# EAGLE design io-ok (EAGLE 6.6.0)

## Sheet 1 of 2
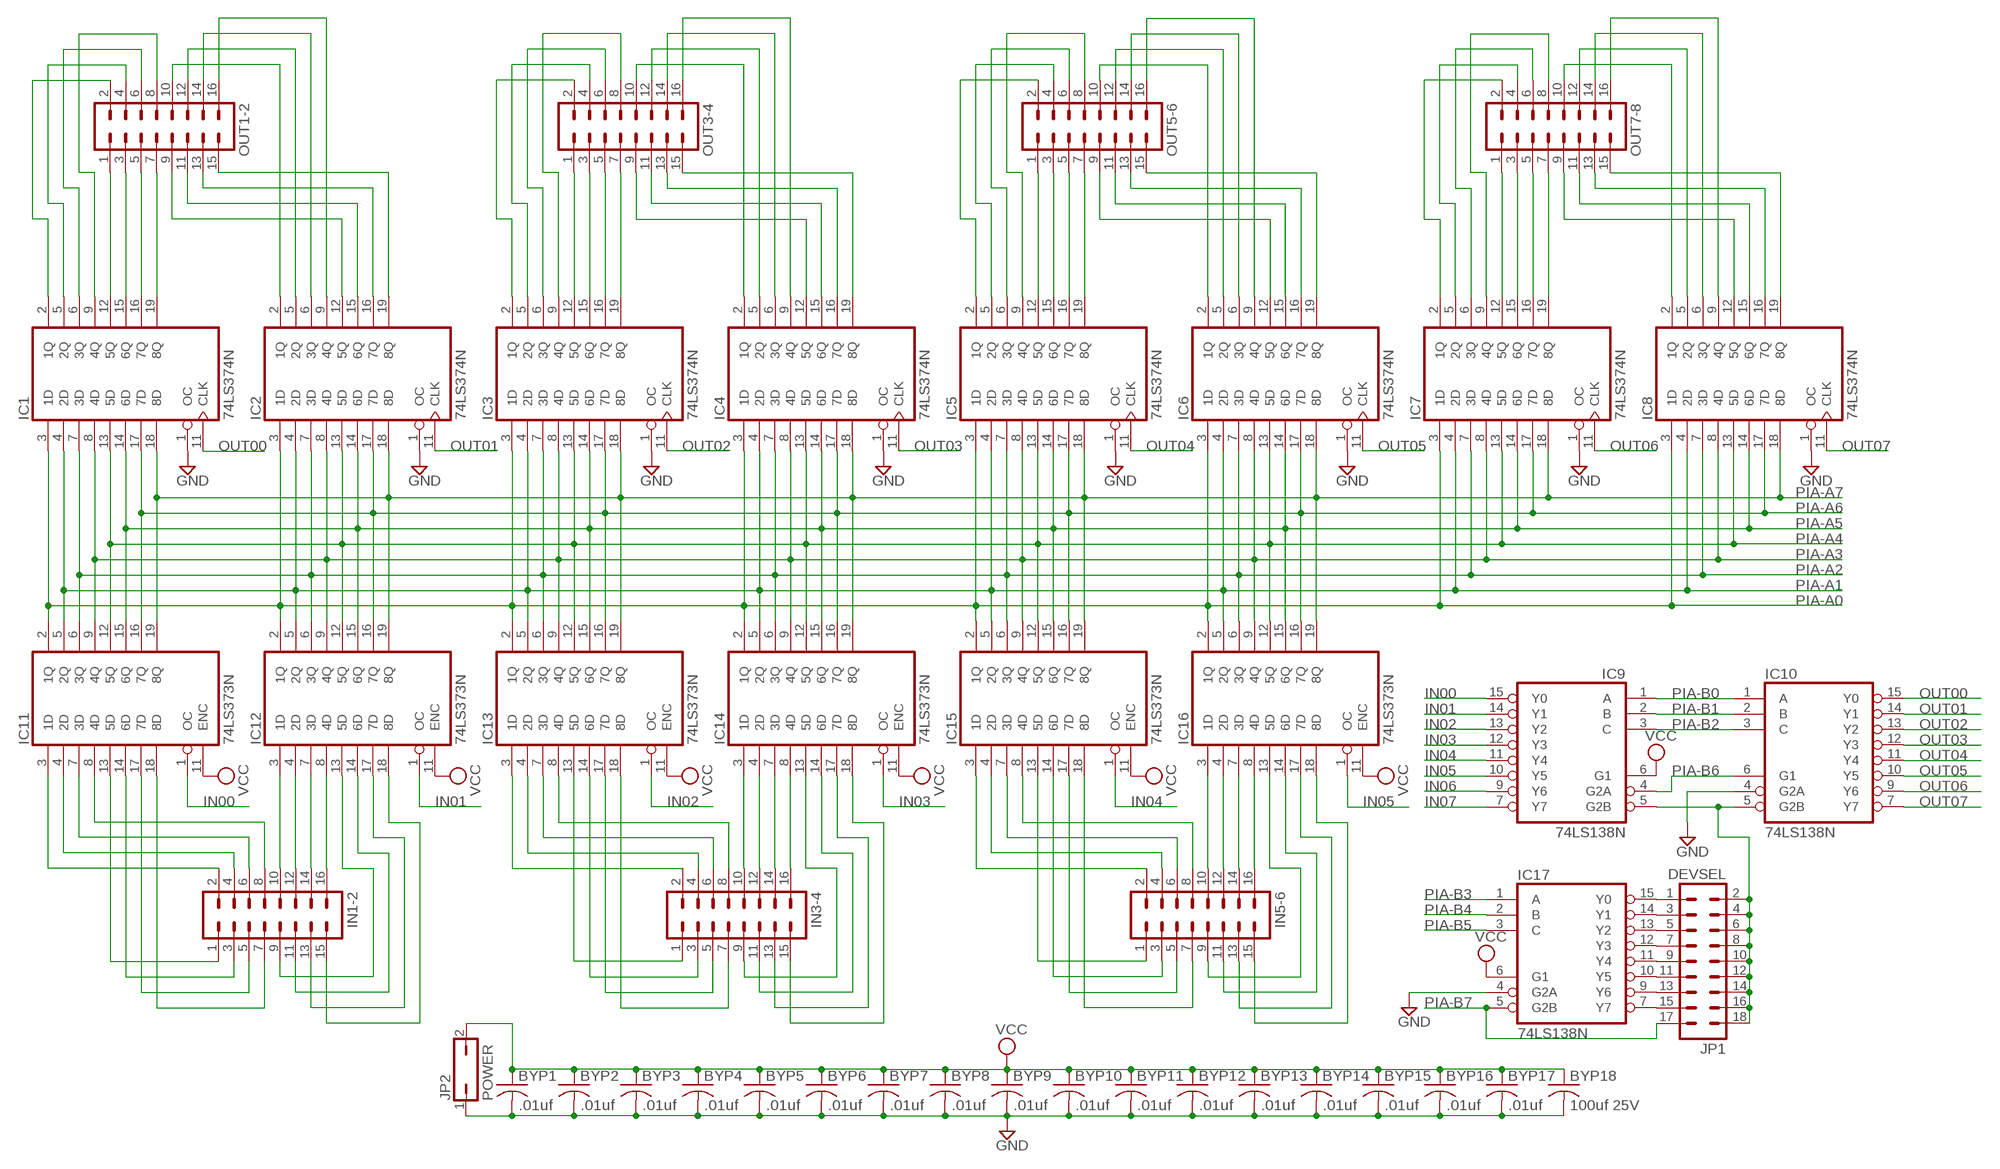
[diagram p0: schematic, sheet 1]

### Parts
BYP1  .01uf  C-US050-025X075  [C050-025X075]
BYP2  .01uf  C-US050-025X075  [C050-025X075]
BYP3  .01uf  C-US050-025X075  [C050-025X075]
BYP4  .01uf  C-US050-025X075  [C050-025X075]
BYP5  .01uf  C-US050-025X075  [C050-025X075]
BYP6  .01uf  C-US050-025X075  [C050-025X075]
BYP7  .01uf  C-US050-025X075  [C050-025X075]
BYP8  .01uf  C-US050-025X075  [C050-025X075]
BYP9  .01uf  C-US050-025X075  [C050-025X075]
BYP10  .01uf  C-US050-025X075  [C050-025X075]
BYP11  .01uf  C-US050-025X075  [C050-025X075]
BYP12  .01uf  C-US050-025X075  [C050-025X075]
BYP13  .01uf  C-US050-025X075  [C050-025X075]
BYP14  .01uf  C-US050-025X075  [C050-025X075]
BYP15  .01uf  C-US050-025X075  [C050-025X075]
BYP16  .01uf  C-US050-025X075  [C050-025X075]
BYP17  .01uf  C-US050-025X075  [C050-025X075]
BYP18  100uf 25V  C-US150-064X183  [C150-064X183]
IC1  74LS374N  [DIL20]
IC2  74LS374N  [DIL20]
IC3  74LS374N  [DIL20]
IC4  74LS374N  [DIL20]
IC5  74LS374N  [DIL20]
IC6  74LS374N  [DIL20]
IC7  74LS374N  [DIL20]
IC8  74LS374N  [DIL20]
IC9  74LS138N  [DIL16]
IC10  74LS138N  [DIL16]
IC11  74LS373N  [DIL20]
IC12  74LS373N  [DIL20]
IC13  74LS373N  [DIL20]
IC14  74LS373N  [DIL20]
IC15  74LS373N  [DIL20]
IC16  74LS373N  [DIL20]
IC17  74LS138N  [DIL16]
IN1-2  MA08-2  [MA08-2]
IN3-4  MA08-2  [MA08-2]
IN5-6  MA08-2  [MA08-2]
JP1  DEVSEL  MA09-2  [MA09-2]
JP2  POWER  JP1Q  [JP1]
OUT1-2  MA08-2  [MA08-2]
OUT3-4  MA08-2  [MA08-2]
OUT5-6  MA08-2  [MA08-2]
OUT7-8  MA08-2  [MA08-2]

### Nets
GND [Power]: BYP1.2 BYP2.2 BYP3.2 BYP4.2 BYP5.2 BYP6.2 BYP7.2 BYP8.2 BYP9.2 BYP10.2 BYP11.2 BYP12.2 BYP13.2 BYP14.2 BYP15.2 BYP16.2 BYP17.2 BYP18.2 IC1.1(OC) IC2.1(OC) IC3.1(OC) IC4.1(OC) IC5.1(OC) IC6.1(OC) IC7.1(OC) IC8.1(OC) IC10.4(G2A) IC17.4(G2A) JP2.1 ; also sheet 2
IN00: IC9.15(Y0) IC11.1(OC)
IN01: IC9.14(Y1) IC12.1(OC)
IN02: IC9.13(Y2) IC13.1(OC)
IN03: IC9.12(Y3) IC14.1(OC)
IN04: IC9.11(Y4) IC15.1(OC)
IN05: IC9.10(Y5) IC16.1(OC)
IN06: IC9.9(Y6)
IN07: IC9.7(Y7)
N$1: IC12.3(1D) IN1-2.10
N$2: IC12.4(2D) IN1-2.12
N$3: IC17.15(Y0) JP1.1
N$4: IC17.14(Y1) JP1.3
N$5: IC17.13(Y2) JP1.5
N$6: IC17.12(Y3) JP1.7
N$7: IC12.7(3D) IN1-2.14
N$8: IC12.8(4D) IN1-2.16
N$9: IC11.8(4D) IN1-2.8
N$10: IC11.7(3D) IN1-2.6
N$11: IC11.4(2D) IN1-2.4
N$12: IC11.3(1D) IN1-2.2
N$13: IC11.13(5D) IN1-2.1
N$14: IC11.14(6D) IN1-2.3
N$15: IC11.17(7D) IN1-2.5
N$16: IC11.18(8D) IN1-2.7
N$17: IC12.13(5D) IN1-2.9
N$18: IC12.14(6D) IN1-2.11
N$19: IC12.17(7D) IN1-2.13
N$20: IC12.18(8D) IN1-2.15
N$21: IC17.11(Y4) JP1.9
N$22: IC17.10(Y5) JP1.11
N$23: IC17.9(Y6) JP1.13
N$24: IC17.7(Y7) JP1.15
N$25: IC9.5(G2B) IC10.5(G2B) JP1.2 JP1.4 JP1.6 JP1.8 JP1.10 JP1.12 JP1.14 JP1.16 JP1.18
N$26: IC5.2(1Q) OUT5-6.2
N$27: IC7.2(1Q) OUT7-8.2
N$29: IC14.3(1D) IN3-4.10
N$30: IC14.4(2D) IN3-4.12
N$31: IC14.7(3D) IN3-4.14
N$32: IC14.8(4D) IN3-4.16
N$33: IC3.12(5Q) OUT3-4.1
N$34: IC3.15(6Q) OUT3-4.3
N$35: IC3.16(7Q) OUT3-4.5
N$36: IC3.19(8Q) OUT3-4.7
N$37: IC13.3(1D) IN3-4.2
N$38: IC13.4(2D) IN3-4.4
N$39: IC13.7(3D) IN3-4.6
N$40: IC13.8(4D) IN3-4.8
N$41: IC14.13(5D) IN3-4.9
N$42: IC14.14(6D) IN3-4.11
N$43: IC14.17(7D) IN3-4.13
N$44: IC14.18(8D) IN3-4.15
N$45: IC13.13(5D) IN3-4.1
N$46: IC13.14(6D) IN3-4.3
N$47: IC13.17(7D) IN3-4.5
N$48: IC13.18(8D) IN3-4.7
N$49: IC3.5(2Q) OUT3-4.4
N$50: IC3.6(3Q) OUT3-4.6
N$51: IC3.2(1Q) OUT3-4.2
N$52: IC3.9(4Q) OUT3-4.8
N$53: IC1.12(5Q) OUT1-2.1
N$54: IC1.15(6Q) OUT1-2.3
N$55: IC1.16(7Q) OUT1-2.5
N$56: IC1.19(8Q) OUT1-2.7
N$57: IC1.2(1Q) OUT1-2.2
N$58: IC1.5(2Q) OUT1-2.4
N$59: IC1.6(3Q) OUT1-2.6
N$60: IC1.9(4Q) OUT1-2.8
N$61: IC2.19(8Q) OUT1-2.15
N$62: IC2.16(7Q) OUT1-2.13
N$63: IC2.15(6Q) OUT1-2.11
N$64: IC2.12(5Q) OUT1-2.9
N$65: IC2.2(1Q) OUT1-2.10
N$66: IC2.5(2Q) OUT1-2.12
N$67: IC2.6(3Q) OUT1-2.14
N$68: IC2.9(4Q) OUT1-2.16
N$69: IC4.2(1Q) OUT3-4.10
N$70: IC4.5(2Q) OUT3-4.12
N$71: IC4.6(3Q) OUT3-4.14
N$72: IC4.9(4Q) OUT3-4.16
N$73: IC4.19(8Q) OUT3-4.15
N$74: IC4.16(7Q) OUT3-4.13
N$75: IC4.15(6Q) OUT3-4.11
N$76: IC4.12(5Q) OUT3-4.9
N$77: IC16.3(1D) IN5-6.10
N$78: IC16.4(2D) IN5-6.12
N$79: IC16.7(3D) IN5-6.14
N$80: IC16.8(4D) IN5-6.16
N$81: IC5.12(5Q) OUT5-6.1
N$82: IC5.15(6Q) OUT5-6.3
N$83: IC5.16(7Q) OUT5-6.5
N$84: IC5.19(8Q) OUT5-6.7
N$85: IC7.12(5Q) OUT7-8.1
N$86: IC7.15(6Q) OUT7-8.3
N$87: IC7.16(7Q) OUT7-8.5
N$88: IC7.19(8Q) OUT7-8.7
N$89: IC5.5(2Q) OUT5-6.4
N$90: IC5.6(3Q) OUT5-6.6
N$91: IC5.9(4Q) OUT5-6.8
N$92: IC6.12(5Q) OUT5-6.9
N$93: IC6.15(6Q) OUT5-6.11
N$95: IC6.16(7Q) OUT5-6.13
N$96: IC6.19(8Q) OUT5-6.15
N$97: IC6.2(1Q) OUT5-6.10
N$98: IC6.5(2Q) OUT5-6.12
N$99: IC6.6(3Q) OUT5-6.14
N$100: IC6.9(4Q) OUT5-6.16
N$101: IC15.3(1D) IN5-6.2
N$102: IC15.4(2D) IN5-6.4
N$103: IC15.7(3D) IN5-6.6
N$104: IC15.8(4D) IN5-6.8
N$105: IC16.13(5D) IN5-6.9
N$106: IC16.14(6D) IN5-6.11
N$107: IC16.17(7D) IN5-6.13
N$108: IC16.18(8D) IN5-6.15
N$109: IC15.13(5D) IN5-6.1
N$110: IC15.14(6D) IN5-6.3
N$111: IC15.17(7D) IN5-6.5
N$112: IC15.18(8D) IN5-6.7
N$113: IC8.19(8Q) OUT7-8.15
N$114: IC8.16(7Q) OUT7-8.13
N$115: IC8.15(6Q) OUT7-8.11
N$116: IC8.12(5Q) OUT7-8.9
N$117: IC8.2(1Q) OUT7-8.10
N$118: IC8.5(2Q) OUT7-8.12
N$119: IC8.6(3Q) OUT7-8.14
N$120: IC8.9(4Q) OUT7-8.16
N$121: IC7.9(4Q) OUT7-8.8
N$122: IC7.6(3Q) OUT7-8.6
N$123: IC7.5(2Q) OUT7-8.4
OUT00: IC1.11(CLK) IC10.15(Y0)
OUT01: IC2.11(CLK) IC10.14(Y1)
OUT02: IC3.11(CLK) IC10.13(Y2)
OUT03: IC4.11(CLK) IC10.12(Y3)
OUT04: IC5.11(CLK) IC10.11(Y4)
OUT05: IC6.11(CLK) IC10.10(Y5)
OUT06: IC7.11(CLK) IC10.9(Y6)
OUT07: IC8.11(CLK) IC10.7(Y7)
PIA-A0: IC1.3(1D) IC2.3(1D) IC3.3(1D) IC4.3(1D) IC5.3(1D) IC6.3(1D) IC7.3(1D) IC8.3(1D) IC11.2(1Q) IC12.2(1Q) IC13.2(1Q) IC14.2(1Q) IC15.2(1Q) IC16.2(1Q) ; also sheet 2
PIA-A1: IC1.4(2D) IC2.4(2D) IC3.4(2D) IC4.4(2D) IC5.4(2D) IC6.4(2D) IC7.4(2D) IC8.4(2D) IC11.5(2Q) IC12.5(2Q) IC13.5(2Q) IC14.5(2Q) IC15.5(2Q) IC16.5(2Q) ; also sheet 2
PIA-A2: IC1.7(3D) IC2.7(3D) IC3.7(3D) IC4.7(3D) IC5.7(3D) IC6.7(3D) IC7.7(3D) IC8.7(3D) IC11.6(3Q) IC12.6(3Q) IC13.6(3Q) IC14.6(3Q) IC15.6(3Q) IC16.6(3Q) ; also sheet 2
PIA-A3: IC1.8(4D) IC2.8(4D) IC3.8(4D) IC4.8(4D) IC5.8(4D) IC6.8(4D) IC7.8(4D) IC8.8(4D) IC11.9(4Q) IC12.9(4Q) IC13.9(4Q) IC14.9(4Q) IC15.9(4Q) IC16.9(4Q) ; also sheet 2
PIA-A4: IC1.13(5D) IC2.13(5D) IC3.13(5D) IC4.13(5D) IC5.13(5D) IC6.13(5D) IC7.13(5D) IC8.13(5D) IC11.12(5Q) IC12.12(5Q) IC13.12(5Q) IC14.12(5Q) IC15.12(5Q) IC16.12(5Q) ; also sheet 2
PIA-A5: IC1.14(6D) IC2.14(6D) IC3.14(6D) IC4.14(6D) IC5.14(6D) IC6.14(6D) IC7.14(6D) IC8.14(6D) IC11.15(6Q) IC12.15(6Q) IC13.15(6Q) IC14.15(6Q) IC15.15(6Q) IC16.15(6Q) ; also sheet 2
PIA-A6: IC1.17(7D) IC2.17(7D) IC3.17(7D) IC4.17(7D) IC5.17(7D) IC6.17(7D) IC7.17(7D) IC8.17(7D) IC11.16(7Q) IC12.16(7Q) IC13.16(7Q) IC14.16(7Q) IC15.16(7Q) IC16.16(7Q) ; also sheet 2
PIA-A7: IC1.18(8D) IC2.18(8D) IC3.18(8D) IC4.18(8D) IC5.18(8D) IC6.18(8D) IC7.18(8D) IC8.18(8D) IC11.19(8Q) IC12.19(8Q) IC13.19(8Q) IC14.19(8Q) IC15.19(8Q) IC16.19(8Q) ; also sheet 2
PIA-B0: IC9.1(A) IC10.1(A) ; also sheet 2
PIA-B1: IC9.2(B) IC10.2(B) ; also sheet 2
PIA-B2: IC9.3(C) IC10.3(C) ; also sheet 2
PIA-B3: IC17.1(A) ; also sheet 2
PIA-B4: IC17.2(B) ; also sheet 2
PIA-B5: IC17.3(C) ; also sheet 2
PIA-B6: IC9.4(G2A) IC10.6(G1) ; also sheet 2
PIA-B7: IC17.5(G2B) JP1.17 ; also sheet 2
VCC [Power]: BYP1.1 BYP2.1 BYP3.1 BYP4.1 BYP5.1 BYP6.1 BYP7.1 BYP8.1 BYP9.1 BYP10.1 BYP11.1 BYP12.1 BYP13.1 BYP14.1 BYP15.1 BYP16.1 BYP17.1 BYP18.1 IC9.6(G1) IC11.11(ENC) IC12.11(ENC) IC13.11(ENC) IC14.11(ENC) IC15.11(ENC) IC16.11(ENC) IC17.6(G1) JP2.2 ; also sheet 2

## Sheet 2 of 2
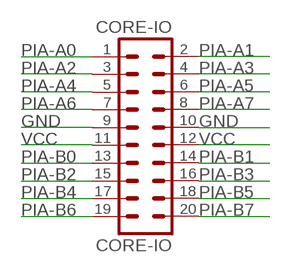
[diagram p1: schematic, sheet 2]

### Parts
CORE-IO  CORE-IO  MA10-2  [MA10-2]

### Nets
GND [Power]: CORE-IO.9 CORE-IO.10 ; also sheet 1
PIA-A0: CORE-IO.1 ; also sheet 1
PIA-A1: CORE-IO.2 ; also sheet 1
PIA-A2: CORE-IO.3 ; also sheet 1
PIA-A3: CORE-IO.4 ; also sheet 1
PIA-A4: CORE-IO.5 ; also sheet 1
PIA-A5: CORE-IO.6 ; also sheet 1
PIA-A6: CORE-IO.7 ; also sheet 1
PIA-A7: CORE-IO.8 ; also sheet 1
PIA-B0: CORE-IO.13 ; also sheet 1
PIA-B1: CORE-IO.14 ; also sheet 1
PIA-B2: CORE-IO.15 ; also sheet 1
PIA-B3: CORE-IO.16 ; also sheet 1
PIA-B4: CORE-IO.17 ; also sheet 1
PIA-B5: CORE-IO.18 ; also sheet 1
PIA-B6: CORE-IO.19 ; also sheet 1
PIA-B7: CORE-IO.20 ; also sheet 1
VCC [Power]: CORE-IO.11 CORE-IO.12 ; also sheet 1

## Power pins joined to a net without a drawn wire
GND: IC1.10(GND) IC2.10(GND) IC3.10(GND) IC4.10(GND) IC5.10(GND) IC6.10(GND) IC7.10(GND) IC8.10(GND) IC9.8(GND) IC10.8(GND) IC11.10(GND) IC12.10(GND) IC13.10(GND) IC14.10(GND) IC15.10(GND) IC16.10(GND) IC17.8(GND)
VCC: IC1.20(VCC) IC2.20(VCC) IC3.20(VCC) IC4.20(VCC) IC5.20(VCC) IC6.20(VCC) IC7.20(VCC) IC8.20(VCC) IC9.16(VCC) IC10.16(VCC) IC11.20(VCC) IC12.20(VCC) IC13.20(VCC) IC14.20(VCC) IC15.20(VCC) IC16.20(VCC) IC17.16(VCC)

## Library data of the parts
BYP1-BYP18 = rcl:C-US: CAPACITOR, American symbol
CORE-IO = con-lstb:MA10-2: PIN HEADER; OC_FARNELL: unknown; OC_NEWARK: unknown
IC1-IC8 = 74xx-us:74*374: Octal D type transparent LATCH, edge triggered
IC9 IC10 IC17 = 74xx-us:74*138: 3-line to 8-line DECODER/DEMULTIPLEXER
IC11-IC16 = 74xx-us:74*373: Octal D type transparent LATCH, edge triggered
IN1-2 IN3-4 IN5-6 OUT1-2 OUT3-4 OUT5-6 OUT7-8 = con-lstb:MA08-2: PIN HEADER; OC_FARNELL: unknown; OC_NEWARK: unknown
JP1 = con-lstb:MA09-2: PIN HEADER; OC_FARNELL: unknown; OC_NEWARK: unknown
JP2 = jumper:JP1Q: JUMPER

## Net classes
1 Power: width 0.508 mm, drill 0.254 mm, clearance 0.254 mm

## Board
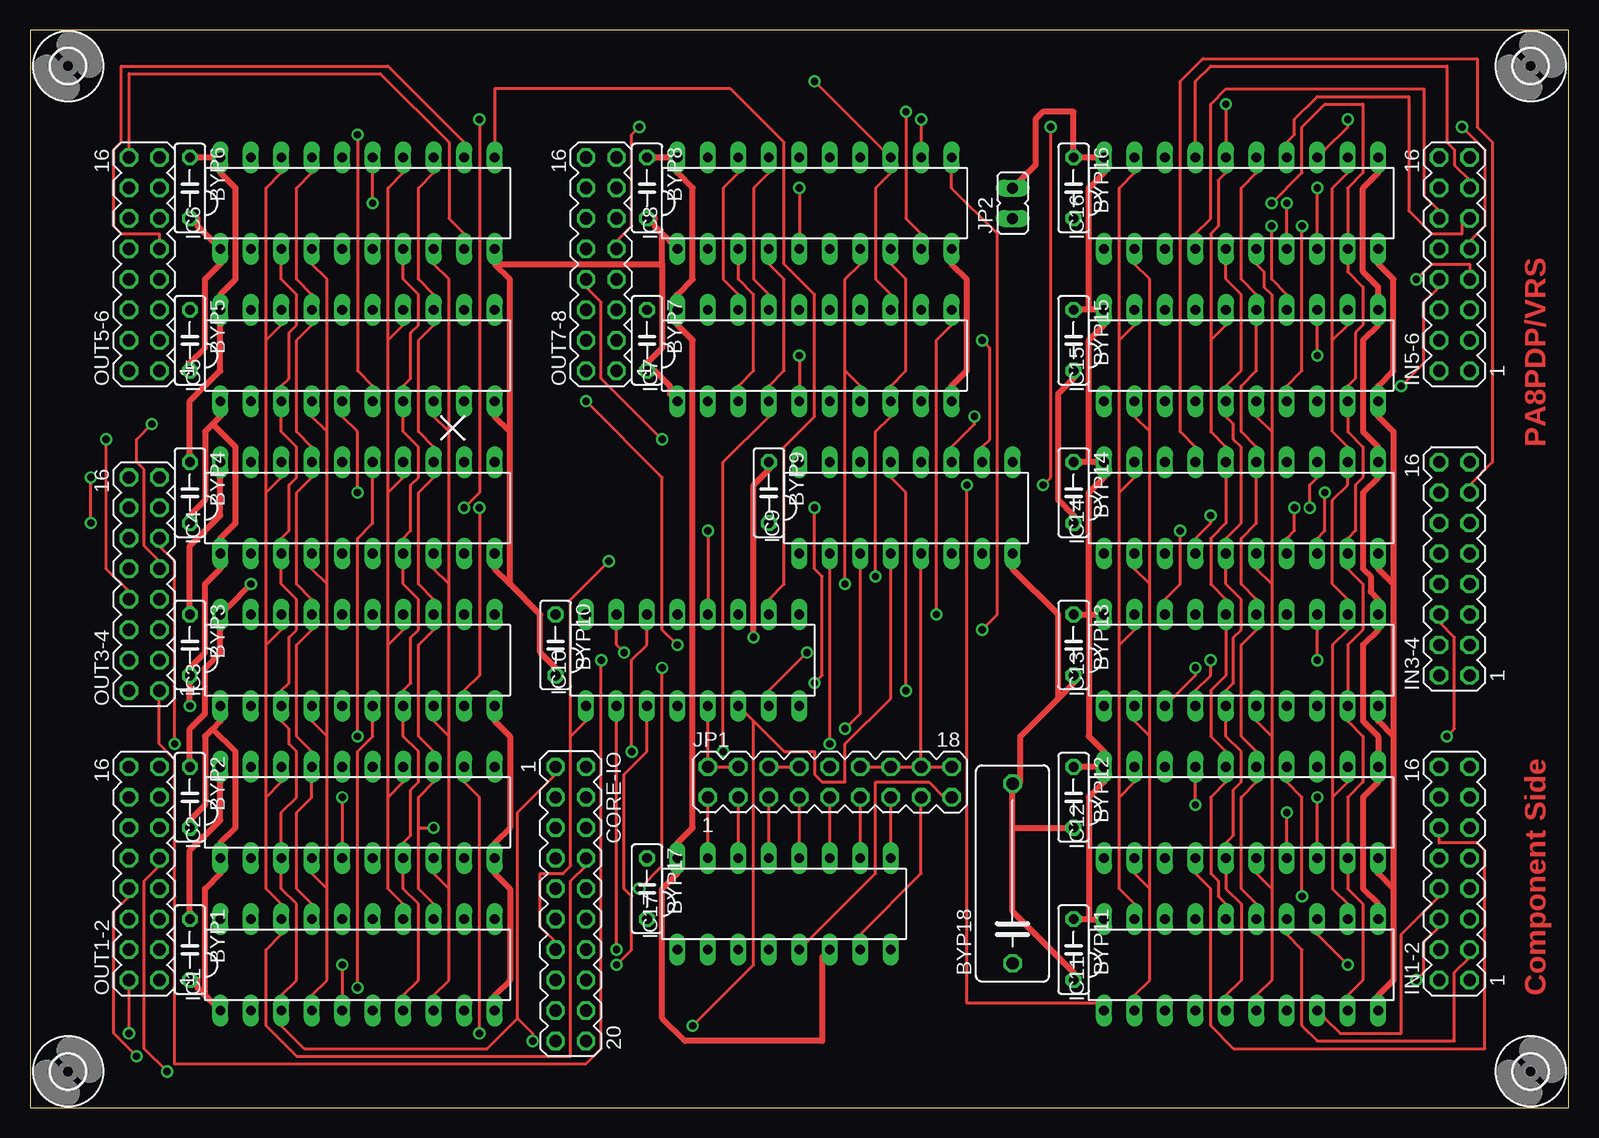
[diagram p2: board, top side]
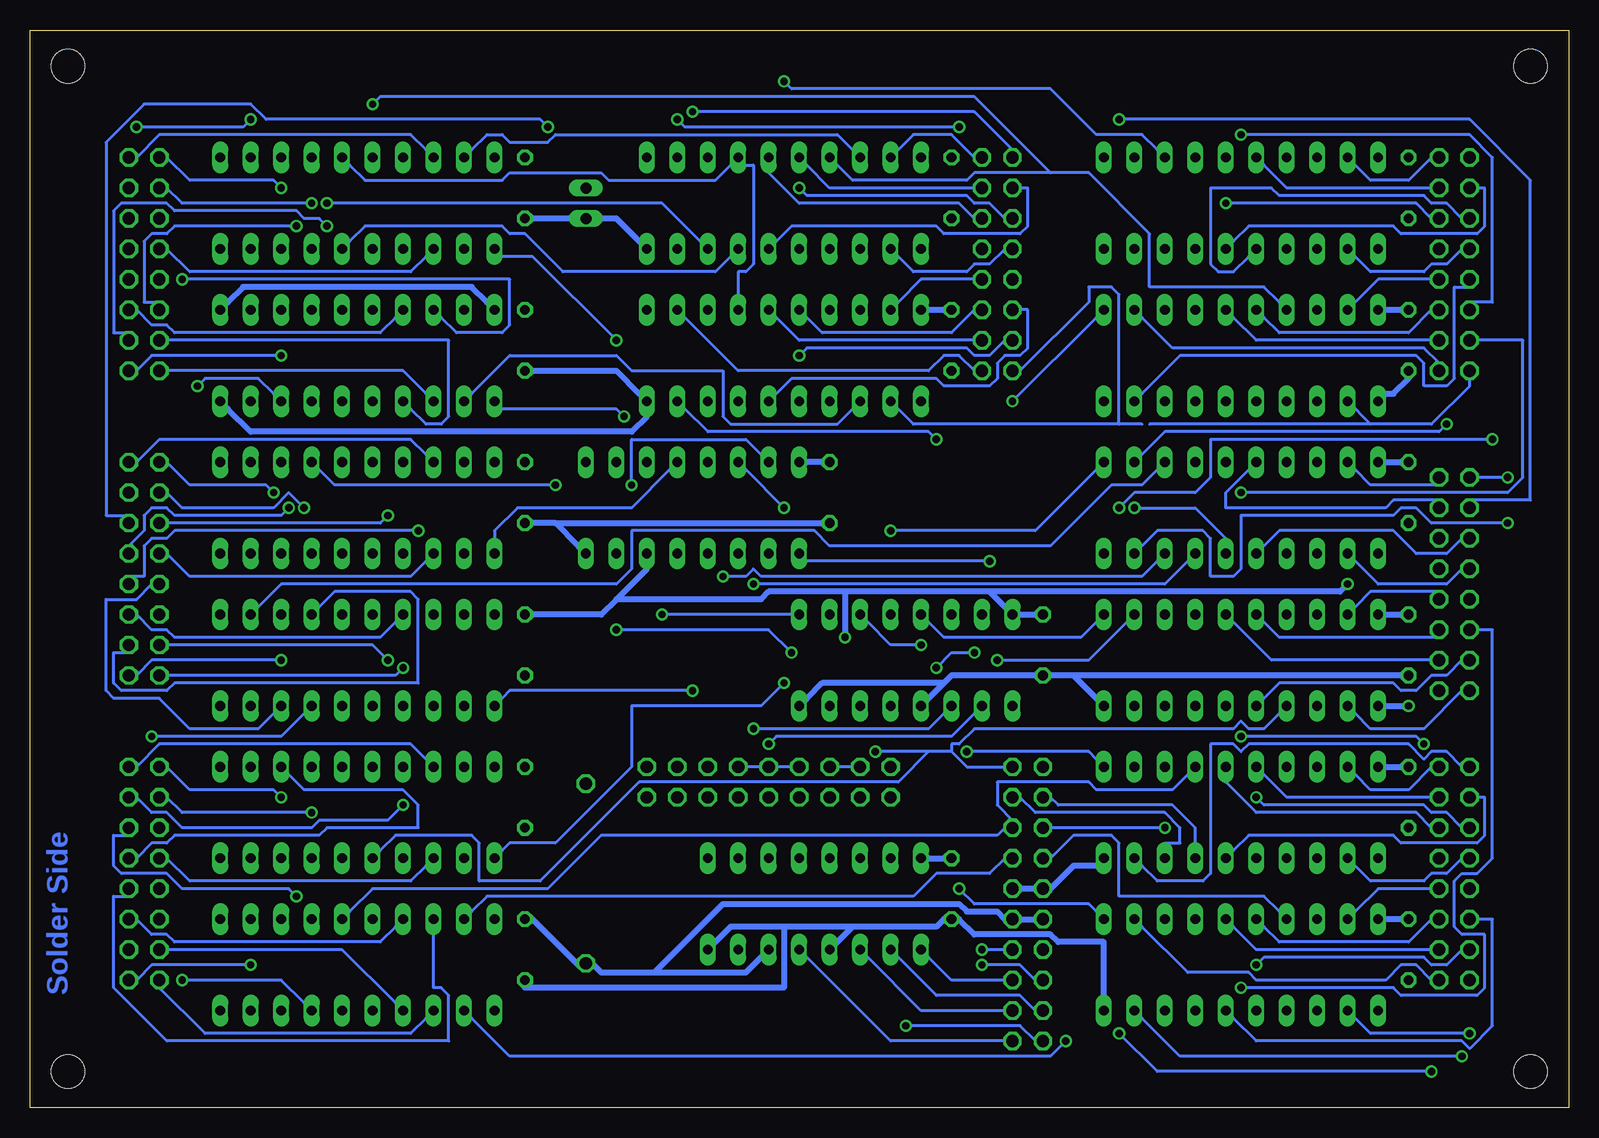
[diagram p3: board, bottom side, seen from below]

Size 128.25 x 89.84 mm. Coordinates in mm from the lower left corner, seen from the top.
Outline: 0,0 128.25,0 128.25,89.84 0,89.84 0,0
Copper layers (1*16): Top 0.035mm / dielectric 1.5mm / Bottom 0.035mm
Design rules "olimex10mil": minimum track width 10mil, minimum drill 24mil, track to track 10mil, track to pad 10mil, pad to pad 10mil, via to via 10mil, smd to smd 10mil, copper to edge 40mil, drill to drill 10mil, minimum pad ring 10mil, minimum via ring 8mil, stop-mask expansion 0mil, vias tented up to drill 0mil, thermal gap 10mil

### Footprints (pad centres in the part's own frame; a part is rotated, then mirrored left to right if it is on the bottom)
C050-025X075 = drill 0.813 octagon: 1 -2.54,0; 2 2.54,0
C150-064X183 = drill 1.016 octagon: 1 -7.493,0; 2 7.493,0
MA10-2 = drill 1.016 octagon: 1 -11.43,-1.27; 2 -11.43,1.27; 3 -8.89,-1.27; 4 -8.89,1.27; 5 -6.35,-1.27; 6 -6.35,1.27; 7 -3.81,-1.27; 8 -3.81,1.27; 9 -1.27,-1.27; 10 -1.27,1.27; 11 1.27,-1.27; 12 1.27,1.27; 13 3.81,-1.27; 14 3.81,1.27; 15 6.35,-1.27; 16 6.35,1.27; 17 8.89,-1.27; 18 8.89,1.27; 19 11.43,-1.27; 20 11.43,1.27
DIL20 = drill 0.813 long: 1 -11.43,-3.81; 2 -8.89,-3.81; 3 -6.35,-3.81; 4 -3.81,-3.81; 5 -1.27,-3.81; 6 1.27,-3.81; 7 3.81,-3.81; 8 6.35,-3.81; 9 8.89,-3.81; 10 11.43,-3.81; 11 11.43,3.81; 12 8.89,3.81; 13 6.35,3.81; 14 3.81,3.81; 15 1.27,3.81; 16 -1.27,3.81; 17 -3.81,3.81; 18 -6.35,3.81; 19 -8.89,3.81; 20 -11.43,3.81
DIL16 = drill 0.813 long: 1 -8.89,-3.81; 2 -6.35,-3.81; 3 -3.81,-3.81; 4 -1.27,-3.81; 5 1.27,-3.81; 6 3.81,-3.81; 7 6.35,-3.81; 8 8.89,-3.81; 9 8.89,3.81; 10 6.35,3.81; 11 3.81,3.81; 12 1.27,3.81; 13 -1.27,3.81; 14 -3.81,3.81; 15 -6.35,3.81; 16 -8.89,3.81
MA08-2 = drill 1.016 octagon: 1 -8.89,-1.27; 2 -8.89,1.27; 3 -6.35,-1.27; 4 -6.35,1.27; 5 -3.81,-1.27; 6 -3.81,1.27; 7 -1.27,-1.27; 8 -1.27,1.27; 9 1.27,-1.27; 10 1.27,1.27; 11 3.81,-1.27; 12 3.81,1.27; 13 6.35,-1.27; 14 6.35,1.27; 15 8.89,-1.27; 16 8.89,1.27
MA09-2 = drill 1.016 octagon: 1 -10.16,-1.27; 2 -10.16,1.27; 3 -7.62,-1.27; 4 -7.62,1.27; 5 -5.08,-1.27; 6 -5.08,1.27; 7 -2.54,-1.27; 8 -2.54,1.27; 9 0,-1.27; 10 0,1.27; 11 2.54,-1.27; 12 2.54,1.27; 13 5.08,-1.27; 14 5.08,1.27; 15 7.62,-1.27; 16 7.62,1.27; 17 10.16,-1.27; 18 10.16,1.27
JP1 = drill 0.914 long: 1 0,-1.27; 2 0,1.27
2,8 = hole 2.8: 0,0

### Placement (x,y rotation side)
BYP1  13.33,13.17 270 top
BYP2  13.33,25.87 270 top
BYP3  13.33,38.57 270 top
BYP4  13.33,51.27 270 top
BYP5  13.33,63.97 270 top
BYP6  13.33,76.67 270 top
BYP7  51.43,63.97 270 top
BYP8  51.43,76.67 270 top
BYP9  61.59,51.27 270 top
BYP10  43.81,38.57 270 top
BYP11  86.99,13.17 270 top
BYP12  86.99,25.87 270 top
BYP13  86.99,38.57 270 top
BYP14  86.99,51.27 270 top
BYP15  86.99,63.97 270 top
BYP16  86.99,76.67 270 top
BYP17  51.43,18.25 270 top
BYP18  81.91,19.52 90 top
CORE-IO  45.08,16.98 270 top
IC1  27.3,11.9 0 top
IC2  27.3,24.6 0 top
IC3  27.3,37.3 0 top
IC4  27.3,50 0 top
IC5  27.3,62.7 0 top
IC6  27.3,75.4 0 top
IC7  65.4,62.7 0 top
IC8  65.4,75.4 0 top
IC9  73.02,50 0 top
IC10  55.24,37.3 0 top
IC11  100.96,11.9 0 top
IC12  100.96,24.6 0 top
IC13  100.96,37.3 0 top
IC14  100.96,50 0 top
IC15  100.96,62.7 0 top
IC16  100.96,75.4 0 top
IC17  62.86,16.98 0 top
IN1-2  118.74,19.52 90 top
IN3-4  118.74,44.92 90 top
IN5-6  118.74,70.32 90 top
JP1  66.67,27.14 0 top
JP2  81.91,75.4 0 top
OUT1-2  9.52,19.52 90 top
OUT3-4  9.52,43.65 90 top
OUT5-6  9.52,70.32 90 top
OUT7-8  47.62,70.32 90 top
U$1  [2,8]  125.09,3.01 0 top
U$2  [2,8]  125.09,86.83 0 top
U$3  [2,8]  3.17,86.83 0 top
U$4  [2,8]  3.17,3.01 0 top

### Tracks (layer width: path | path; a pad name or v marks a point on that pad's centre or on a via)
GND  (via drill 0.61)
  Top 0.508: 15.24,31.58 15.87,32.22 IC3.1 | 15.24,31.58 14.6,30.95 14.6,25.23 13.33,23.96 BYP2.2 | 14.6,9.36 13.97,10 13.97,10.63 BYP1.2 | 14.6,9.36 15.24,8.73 IC1.1 | 14.6,9.36 14.6,18.25 15.87,19.52 IC2.1 15.87,22.06 17.14,23.33 17.14,29.68 15.24,31.58 | BYP6.2 13.97,74.13 13.97,73.5 15.24,72.22 IC6.1 15.87,70.32 14.6,69.05 14.6,63.34 13.33,62.06 BYP5.2 | 15.24,56.98 15.87,57.62 IC5.1 | 15.24,56.98 14.6,56.35 14.6,50.63 13.33,49.37 BYP4.2 | 15.24,56.98 17.14,55.08 17.14,48.73 15.87,47.46 IC4.1 15.87,44.92 14.6,43.65 14.6,37.94 13.33,36.66 BYP3.2 13.33,35.39 v13.33,33.49 | IC1.10 38.73,9.36 40,10.63 40,18.25 38.73,19.52 IC2.10 38.73,22.06 40,23.33 40,30.95 38.73,32.22 IC3.10 | IC7.1 53.34,59.52 53.34,60.16 52.07,61.43 BYP7.2 51.43,62.06 52.7,63.34 52.7,70.32 | 52.7,72.86 52.07,73.5 52.07,74.13 BYP8.2 | 52.7,72.86 53.34,72.22 IC8.1 | 52.7,70.32 52.7,72.86 | 40,43.65 42.54,41.11 42.54,37.94 43.81,36.66 BYP10.2 | 40,43.65 38.73,44.92 IC4.10 | 40,56.35 38.73,57.62 IC5.10 | 40,43.65 40,56.35 | 38.73,70.32 40,69.05 40,56.35 | 38.73,70.32 IC6.10 38.73,70.32 | 38.73,70.32 52.7,70.32 | 113.66,18.25 113.66,10.63 112.39,9.36 IC11.10 | 113.66,18.25 112.39,19.52 IC12.10 | 113.66,30.95 112.39,32.22 IC13.10 | 113.66,30.95 113.66,18.25 | 113.66,43.65 112.39,44.92 IC14.10 | 113.66,43.65 113.66,30.95 | 113.66,43.65 113.66,56.35 112.39,57.62 IC15.10 112.39,60.16 113.66,61.43 113.66,69.05 112.39,70.32 IC16.10 | IC7.10 76.83,60.16 78.1,61.43 78.1,69.05 76.83,70.32 IC8.10 | BYP15.2 86.99,60.8 85.72,59.52 85.72,50.63 86.99,49.37 BYP14.2 | 81.91,23.33 81.91,26.5 BYP18.2 82.55,27.14 82.55,30.95 85.72,34.12
  Top 0.508: 81.91,23.33 81.91,16.34 86.99,11.27 BYP11.2 | 81.91,23.33 86.35,23.33 BYP12.2 | 85.72,34.12 86.99,35.39 BYP13.2 | 85.72,34.12 85.72,41.11 81.91,44.92 IC9.8
  Bottom 0.508: BYP5.2 13.33,60.8 14.6,59.52 15.24,59.52 IC5.1 | v13.33,33.49 15.24,33.49 IC3.1 | CORE-IO.10 45.72,18.25 44.45,18.25 CORE-IO.9 43.18,18.25 41.27,20.15 39.37,20.15 IC2.10 | 41.27,36.03 39.37,34.12 IC3.10 | 41.27,36.03 43.18,36.03 BYP10.2 44.45,36.03 51.43,36.03 52.07,35.39 | 52.07,35.39 53.34,34.12 IC10.4 | 52.07,35.39 62.23,35.39 63.5,34.12 IC10.8 | 41.27,36.03 13.97,36.03 BYP3.2 | BYP15.2 86.35,61.43 79.37,61.43 77.46,59.52 IC7.10 76.83,57.62 78.1,56.35 109.85,56.35 111.75,58.25 IC15.10 | IC8.10 77.46,72.22 79.37,74.13 80.64,74.13 JP2.1 83.18,74.13 86.35,74.13 BYP16.2 | 84.45,48.73 82.55,46.82 IC9.8 | 84.45,48.73 86.35,48.73 BYP14.2 | 84.45,48.73 62.23,48.73 BYP9.2 | 59.69,15.08 52.7,15.08 52.07,15.71 BYP17.2 50.8,15.71 49.53,14.44 43.18,14.44 42.54,13.81 38.73,13.81 38.73,9.36 IC1.10 | 59.69,15.08 60.96,13.81 IC17.4 | 59.69,15.08 65.4,15.08 | 65.4,15.08 69.84,15.08 71.11,13.81 IC17.8 | 65.4,15.08 65.4,10 86.99,10 BYP11.2
IN00  (via drill 0.61)
  Top 0.254: v78.1,51.91 78.1,8.73 88.89,8.73 IC11.1
  Bottom 0.254: v78.1,51.91 78.1,55.71 68.57,55.71 67.3,54.45 IC9.15
IN01  (via drill 0.61)
  Top 0.254: v65.4,35.39 66.03,36.03 66.03,44.28 65.4,44.92 v65.4,50
  Bottom 0.254: v65.4,35.39 67.3,33.49 78.1,33.49 78.1,28.41 84.45,22.06 88.26,22.06 88.89,21.42 IC12.1 | v65.4,50 68.57,53.17 IC9.14
IN02  (via drill 0.61)
  Top 0.254: v73.02,34.76 73.02,51.27 71.75,52.54 IC9.13
  Bottom 0.254: v73.02,34.76 88.26,34.76 88.89,34.12 IC13.1
IN03
  Bottom 0.254: IC9.12 74.92,53.17 78.1,50 87.62,50 89.53,48.09 89.53,47.46 IC14.1
IN04  (via drill 0.61)
  Top 0.254: v78.73,57.62 78.73,56.98 76.83,55.08 IC9.11
  Bottom 0.254: v78.73,57.62 79.37,58.25 88.89,58.25 IC15.1
IN05  (via drill 0.61)
  Top 0.254: v79.37,63.97 80,63.34 80,55.71 79.37,55.08 IC9.10
  Bottom 0.254: v79.37,63.97 86.35,70.95 88.89,70.95 IC16.1
N$1
  Bottom 0.254: IC12.3 95.24,20.15 96.52,18.88 114.93,18.88 116.83,20.79 IN1-2.10
N$2
  Top 0.254: IC12.4 97.15,19.52 98.42,18.25 98.42,6.82 100.32,4.92 121.28,4.92 121.28,21.42 120.64,22.06 117.47,22.06 117.47,22.7 IN1-2.12
N$3
  Top 0.254: IC17.15 56.51,22.06 56.51,25.23 JP1.1
N$4
  Top 0.254: IC17.14 59.05,22.06 59.05,25.23 JP1.3
N$5
  Top 0.254: IC17.13 61.59,22.06 61.59,25.23 JP1.5
N$6
  Top 0.254: IC17.12 64.13,22.06 64.13,25.23 JP1.7
N$7  (via drill 0.61)
  Top 0.254: v104.77,24.6 104.77,22.06 IC12.7
  Bottom 0.254: v104.77,24.6 115.56,24.6 116.83,25.87 IN1-2.14
N$8  (via drill 0.61)
  Top 0.254: v107.31,25.87 107.31,22.06 IC12.8
  Bottom 0.254: v107.31,25.87 107.94,26.5 114.93,26.5 116.83,28.41 IN1-2.16
N$9
  Top 0.254: IC11.8 107.94,7.46 109.21,6.18 114.3,6.18 114.3,14.44 117.47,17.61 IN1-2.8
N$10  (via drill 0.61)
  Top 0.254: v115.56,10.63 116.2,11.27 116.2,13.81 117.47,15.08 IN1-2.6
  Bottom 0.254: v115.56,10.63 107.31,10.63 105.41,8.73 IC11.7
N$11
  Bottom 0.254: IC11.4 97.78,8.73 102.23,13.17 116.83,13.17 IN1-2.4
N$12
  Bottom 0.254: IC11.3 95.24,7.46 96.52,6.18 113.66,6.18 117.47,10 IN1-2.2
N$13  (via drill 0.61)
  Top 0.254: v109.85,11.9 107.31,14.44 IC11.13
  Bottom 0.254: v109.85,11.9 118.1,11.9 119.38,10.63 IN1-2.1
N$14
  Top 0.254: IC11.14 104.77,14.44 106.04,13.17 106.04,6.82 107.31,5.55 118.74,5.55 118.74,11.27 120.01,12.54 IN1-2.3
N$15
  Bottom 0.254: IC11.17 97.78,15.08 99.05,13.81 116.2,13.81 116.83,14.44 118.1,14.44 119.38,15.71 IN1-2.5
N$16
  Bottom 0.254: IC11.18 94.61,14.44 94.61,10 93.97,10 93.34,9.36 93.34,5.55 116.83,5.55 121.28,10 121.28,17.61 120.01,17.61 IN1-2.7
N$17
  Bottom 0.254: IC12.13 106.67,27.77 105.41,26.5 97.15,26.5 95.88,25.23 95.88,23.33 103.5,23.33 104.13,22.7 116.2,22.7 116.83,22.06 118.1,22.06 119.38,20.79 IN1-2.9
N$18  (via drill 0.61)
  Top 0.254: v106.04,17.61 106.04,25.87 104.77,27.14 IC12.14
  Bottom 0.254: v106.04,17.61 106.67,18.25 115.56,18.25 116.83,19.52 120.64,19.52 121.28,20.15 121.28,22.7 120.01,22.7 IN1-2.11
N$19  (via drill 0.61)
  Top 0.254: v97.15,25.23 97.15,27.14 IC12.17
  Bottom 0.254: v97.15,25.23 98.42,23.96 104.13,23.96 104.77,23.33 115.56,23.33 116.83,24.6 118.1,24.6 119.38,25.87 IN1-2.13
N$20
  Bottom 0.254: IC12.18 95.24,29.04 96.52,30.31 117.47,30.31 119.38,28.41 IN1-2.15
N$21
  Top 0.254: IC17.11 66.67,22.06 66.67,25.23 JP1.9
N$22
  Top 0.254: IC17.10 69.21,22.06 69.21,25.23 JP1.11
N$23
  Top 0.254: IC17.9 71.75,22.06 71.75,25.23 JP1.13
N$24
  Top 0.254: IC17.7 69.21,14.44 74.29,19.52 74.29,25.23 JP1.15
N$25
  Top 0.254: IC10.5 56.51,32.22 56.51,29.04 JP1.2 57.15,28.41 58.41,28.41 JP1.4 | JP1.8 63.5,28.41 62.23,28.41 JP1.6 | JP1.12 69.84,28.41 71.11,28.41 JP1.14 72.38,28.41 73.66,28.41 JP1.16 | IC9.5 74.29,44.92 74.29,29.04 JP1.16 | JP1.18 76.19,28.41 74.92,28.41 JP1.16
  Bottom 0.254: JP1.6 60.96,28.41 59.69,28.41 JP1.4 | JP1.8 64.77,28.41 66.03,28.41 JP1.10 67.3,28.41 68.57,28.41 JP1.12
N$26
  Bottom 0.254: 16.5,56.98 IC5.2 | 16.5,56.98 34.92,56.98 | 16.5,56.98 11.43,56.98 8.25,60.16 OUT5-6.2
N$27
  Bottom 0.254: IC7.2 54.61,56.98 37.46,56.98 | 35.55,56.98 37.46,56.98 | 37.46,56.98 37.46,67.78 38.1,68.41 40,68.41 40,67.14 45.72,61.43 OUT7-8.2
N$29
  Bottom 0.254: IC14.3 95.24,45.55 96.52,44.28 114.93,44.28 116.83,46.19 IN3-4.10
N$30  (via drill 0.61)
  Top 0.254: v98.42,49.37 98.42,48.73 97.15,47.46 IC14.4
  Bottom 0.254: v98.42,49.37 99.05,48.73 116.83,48.73 IN3-4.12
N$31  (via drill 0.61)
  Top 0.254: v105.41,50 105.41,48.09 104.77,47.46 IC14.7
  Bottom 0.254: v105.41,50 106.67,51.27 107.94,50 115.56,50 116.83,51.27 IN3-4.14
N$32  (via drill 0.61)
  Top 0.254: v107.94,51.27 107.94,48.09 107.31,47.46 IC14.8
  Bottom 0.254: v107.94,51.27 108.58,51.91 114.93,51.91 116.83,53.81 IN3-4.16
N$33  (via drill 0.61)
  Top 0.254: v47.62,37.3 47.62,4.92 46.35,3.64 12.06,3.64 12.06,29.04 10.79,30.31 10.79,34.12 OUT3-4.1
  Bottom 0.254: v47.62,37.3 40,37.3 36.83,40.48 IC3.12
N$34
  Bottom 0.254: IC3.15 27.93,40.48 24.76,37.3 11.43,37.3 OUT3-4.3
N$35
  Bottom 0.254: IC3.16 25.39,40.48 24.12,39.2 10.79,39.2 OUT3-4.5
N$36
  Bottom 0.254: IC3.19 17.77,41.74 16.5,43.02 10.79,43.02 OUT3-4.7
N$37  (via drill 0.61)
  Top 0.254: v97.15,36.66 97.15,36.03 95.24,34.12 IC13.3
  Bottom 0.254: v97.15,36.66 97.78,36.03 116.83,36.03 IN3-4.2
N$38  (via drill 0.61)
  Top 0.254: v98.42,37.3 98.42,36.03 97.15,34.76 IC13.4
  Bottom 0.254: v98.42,37.3 99.69,38.57 116.83,38.57 IN3-4.4
N$39  (via drill 0.61)
  Top 0.254: v118.1,30.95 118.74,31.58 118.74,39.2 117.47,40.48 IN3-4.6
  Bottom 0.254: v118.1,30.95 107.31,30.95 105.41,32.85 IC13.7
N$40
  Bottom 0.254: IC13.8 107.94,32.85 109.21,31.58 114.93,31.58 117.47,34.12 121.28,34.12 121.91,34.76 121.91,42.38 119.38,42.38 118.1,43.65 IN3-4.8
N$41  (via drill 0.61)
  Top 0.254: v106.67,50 106.67,51.91 107.31,52.54 IC14.13
  Bottom 0.254: v106.67,50 107.31,49.37 116.2,49.37 116.83,50 118.1,50 118.74,49.37 118.74,48.09 120.01,46.82 IN3-4.9
N$42  (via drill 0.61)
  Top 0.254: v84.45,51.91 85.08,52.54 v85.08,81.75
  Bottom 0.254: v84.45,51.91 102.86,51.91 104.13,53.17 IC14.14 | v85.08,81.75 85.72,82.39 108.58,82.39 109.85,83.66 118.74,83.66 121.91,80.48 121.91,49.37 120.01,49.37 IN3-4.11
N$43
  Top 0.254: IC14.17 97.15,55.08 95.88,56.35 95.88,85.56 97.78,87.47 120.64,87.47 120.64,81.75 121.91,80.48 121.91,53.81 120.01,51.91 IN3-4.13
N$44
  Bottom 0.254: IC14.18 95.24,54.45 96.52,55.71 117.47,55.71 119.38,53.81 IN3-4.15
N$45  (via drill 0.61)
  Top 0.254: v107.31,37.3 107.31,39.84 IC13.13
  Bottom 0.254: v107.31,37.3 118.1,37.3 119.38,36.03 IN3-4.1
N$46
  Bottom 0.254: IC13.14 104.13,41.74 102.86,43.02 96.52,43.02 95.88,42.38 95.88,35.39 116.2,35.39 116.83,34.76 120.64,34.76 121.28,35.39 121.28,37.94 120.01,37.94 IN3-4.3
N$47
  Bottom 0.254: IC13.17 97.78,40.48 99.05,39.2 116.2,39.2 116.83,39.84 118.1,39.84 119.38,41.11 IN3-4.5
N$48  (via drill 0.61)
  Top 0.254: v95.88,48.09 95.88,43.65 94.61,42.38 IC13.18
  Bottom 0.254: v95.88,48.09 116.2,48.09 116.83,47.46 118.1,47.46 118.74,46.82 118.74,44.28 120.01,44.28 IN3-4.7
N$49
  Bottom 0.254: IC3.5 25.39,34.12 24.12,35.39 14.6,35.39 13.97,34.76 12.7,34.76 11.43,36.03 10.16,36.03 8.89,37.3 OUT3-4.4
N$50  (via drill 0.61)
  Top 0.254: v27.3,10 27.3,29.68 28.57,30.95 28.57,32.22 IC3.6
  Bottom 0.254: v27.3,10 14.6,10 13.97,9.36 7.62,9.36 6.98,10 6.98,14.44 8.89,14.44 9.52,15.08 9.52,18.88 8.89,19.52 7.62,19.52 6.34,20.79 6.34,39.84 7.62,39.84 OUT3-4.6
N$51
  Bottom 0.254: IC3.2 17.77,32.85 16.5,31.58 12.06,31.58 8.89,34.76 OUT3-4.2
N$52  (via drill 0.61)
  Top 0.254: v37.46,50 37.46,36.03 36.19,34.76 IC3.9 | v6.34,55.71 6.34,44.92 8.25,43.02 OUT3-4.8
  Bottom 0.254: v37.46,50 36.19,51.27 31.11,51.27 29.84,52.54 29.84,55.71 v6.34,55.71
N$53
  Bottom 0.254: IC1.12 35.55,15.08 31.74,11.27 26.66,11.27 26.03,10.63 15.24,10.63 13.97,11.9 12.7,11.9 11.43,10.63 OUT1-2.1
N$54
  Bottom 0.254: IC1.15 27.93,15.08 26.03,13.17 11.43,13.17 OUT1-2.3
N$55
  Bottom 0.254: IC1.16 25.39,15.08 24.12,13.81 13.33,13.81 11.43,15.71 OUT1-2.5
N$56
  Bottom 0.254: IC1.19 17.77,16.34 15.87,18.25 11.43,18.25 OUT1-2.7
N$57  (via drill 0.61)
  Top 0.254: v8.25,6.18 8.25,10 OUT1-2.2
  Bottom 0.254: v8.25,6.18 16.5,6.18 17.77,7.46 IC1.2
N$58  (via drill 0.61)
  Top 0.254: v26.03,11.9 26.03,9.36 IC1.5
  Bottom 0.254: v26.03,11.9 25.39,12.54 12.06,12.54 11.43,11.9 10.16,11.9 8.89,13.17 OUT1-2.4
N$59
  Bottom 0.254: IC1.6 27.93,7.46 26.03,5.55 8.89,5.55 8.25,4.92 6.34,6.82 6.34,15.71 7.62,15.71 OUT1-2.6
N$60  (via drill 0.61)
  Top 0.254: v8.89,4.28 6.98,6.18 6.98,16.34 8.25,17.61 OUT1-2.8
  Bottom 0.254: v8.89,4.28 32.38,4.28 35.55,7.46 IC1.9
N$61
  Bottom 0.254: IC2.19 17.77,27.77 16.5,26.5 13.33,26.5 11.43,28.41 OUT1-2.15
N$62
  Bottom 0.254: IC2.16 25.39,27.77 23.49,25.87 11.43,25.87 OUT1-2.13
N$63
  Bottom 0.254: IC2.15 28.57,27.14 26.03,24.6 12.7,24.6 11.43,23.33 OUT1-2.11
N$64  (via drill 0.61)
  Top 0.254: v37.46,6.18 37.46,25.87 36.19,27.14 IC2.12 | v11.43,3.01 9.52,4.92 9.52,18.88 10.79,20.15 OUT1-2.9
  Bottom 0.254: v37.46,6.18 34.29,3.01 v11.43,3.01
N$65
  Bottom 0.254: IC2.2 17.77,20.15 16.5,18.88 12.06,18.88 11.43,19.52 10.16,19.52 8.89,20.79 OUT1-2.10
N$66  (via drill 0.61)
  Top 0.254: v26.03,25.87 26.03,22.06 IC2.5
  Bottom 0.254: v26.03,25.87 25.39,25.23 12.06,25.23 11.43,24.6 10.16,24.6 8.89,23.33 OUT1-2.12
N$67
  Bottom 0.254: IC2.6 27.93,21.42 26.66,22.7 14.6,22.7 13.97,22.06 7.62,22.06 6.98,22.7 6.98,25.87 7.62,25.87 OUT1-2.14
N$68
  Bottom 0.254: IC2.9 35.55,20.15 34.29,18.88 30.47,18.88 29.84,19.52 29.84,30.31 27.93,30.31 27.3,29.68 26.66,30.31 13.33,30.31 12.06,29.04 11.43,29.68 10.16,29.68 8.89,28.41 OUT1-2.16
N$69
  Bottom 0.254: IC4.2 17.77,45.55 15.87,43.65 10.16,43.65 8.89,44.92 OUT3-4.10
N$70
  Bottom 0.254: IC4.5 25.39,46.82 24.12,48.09 14.6,48.09 12.7,46.19 10.16,46.19 8.89,47.46 OUT3-4.12
N$71  (via drill 0.61)
  Top 0.254: v36.19,50 37.46,51.27 v37.46,82.39
  Bottom 0.254: v36.19,50 31.11,50 28.57,47.46 IC4.6 | v37.46,82.39 8.25,82.39 3.17,77.3 3.17,50.63 8.25,50.63 OUT3-4.14
N$72  (via drill 0.61)
  Top 0.254: v5.08,48.73 v5.08,52.54
  Bottom 0.254: v5.08,48.73 11.43,48.73 12.7,50 13.97,50 14.6,49.37 27.3,49.37 27.3,44.92 27.93,44.28 29.84,44.28 29.84,47.46 30.47,48.09 34.29,48.09 35.55,46.82 IC4.9 | v5.08,52.54 7.62,52.54 OUT3-4.16
N$73
  Bottom 0.254: IC4.19 17.77,53.17 16.5,51.91 10.79,51.91 OUT3-4.15
N$74
  Bottom 0.254: IC4.16 26.66,53.17 28.57,51.27 28.57,50 15.24,50 14.6,50.63 10.79,50.63 OUT3-4.13
N$75  (via drill 0.61)
  Top 0.254: v27.3,30.95 27.3,47.46 28.57,48.73 28.57,52.54 IC4.15 | v12.06,30.31 12.06,45.55 10.79,46.82 OUT3-4.11
  Bottom 0.254: v27.3,30.95 12.7,30.95 v12.06,30.31
N$76  (via drill 0.61)
  Top 0.254: v10.16,56.98 8.89,55.71 8.89,53.81 9.52,53.17 9.52,46.82 10.79,45.55 OUT3-4.9
  Bottom 0.254: v10.16,56.98 10.79,56.35 33.65,56.35 35.55,54.45 IC4.12
N$77
  Bottom 0.254: IC16.3 95.24,70.95 96.52,69.69 114.93,69.69 116.83,71.59 IN5-6.10
N$78
  Top 0.254: IC16.4 97.15,72.86 98.42,74.13 98.42,83.66 99.69,84.92 116.2,84.92 116.2,76.03 117.47,74.77 IN5-6.12
N$79  (via drill 0.61)
  Top 0.254: v104.77,75.4 104.77,72.86 IC16.7
  Bottom 0.254: v104.77,75.4 115.56,75.4 116.83,76.67 IN5-6.14
N$80  (via drill 0.61)
  Top 0.254: v107.31,76.67 107.31,72.86 IC16.8
  Bottom 0.254: v107.31,76.67 107.94,77.3 114.93,77.3 116.83,79.21 IN5-6.16
N$81
  Bottom 0.254: IC5.12 35.55,65.88 33.02,63.34 12.06,63.34 10.79,62.06 OUT5-6.1
N$82
  Bottom 0.254: IC5.15 27.93,65.88 26.03,63.97 11.43,63.97 OUT5-6.3
N$83
  Bottom 0.254: IC5.16 25.39,65.88 24.12,64.61 13.33,64.61 11.43,66.51 OUT5-6.5
N$84
  Bottom 0.254: IC5.19 17.77,67.14 15.87,69.05 11.43,69.05 OUT5-6.7
N$85
  Bottom 0.254: IC7.12 73.66,65.88 69.21,61.43 53.34,61.43 52.07,62.7 50.8,62.7 49.53,61.43 OUT7-8.1
N$86
  Bottom 0.254: IC7.15 66.03,65.88 64.13,63.97 49.53,63.97 OUT7-8.3
N$87
  Bottom 0.254: IC7.16 63.5,65.88 62.23,64.61 51.43,64.61 49.53,66.51 OUT7-8.5
N$88
  Bottom 0.254: IC7.19 55.88,67.14 53.97,69.05 49.53,69.05 OUT7-8.7
N$89  (via drill 0.61)
  Top 0.254: v27.3,51.27 27.3,56.35 26.03,57.62 IC5.5
  Bottom 0.254: v27.3,51.27 5.08,51.27 3.8,52.54 3.8,63.97 7.62,63.97 OUT5-6.4
N$90  (via drill 0.61)
  Top 0.254: v27.3,81.11 27.3,61.43 28.57,60.16 IC5.6
  Bottom 0.254: v27.3,81.11 8.25,81.11 6.34,79.21 6.34,67.14 8.25,67.14 OUT5-6.6
N$91
  Bottom 0.254: IC5.9 35.55,59.52 32.38,62.7 12.7,62.7 12.06,62.06 12.06,60.16 10.16,60.16 9.52,60.8 9.52,68.41 8.25,68.41 OUT5-6.8
N$92
  Top 0.254: IC6.12 36.19,80.48 29.84,86.83 7.62,86.83 7.62,80.48 6.98,79.84 6.98,73.5 7.62,72.86 10.79,72.86 10.79,72.22 OUT5-6.9
N$93  (via drill 0.61)
  Top 0.254: v28.57,75.4 28.57,77.94 IC6.15
  Bottom 0.254: v28.57,75.4 12.7,75.4 11.43,74.13 OUT5-6.11
N$95
  Bottom 0.254: IC6.16 25.39,78.58 23.49,76.67 11.43,76.67 OUT5-6.13
N$96
  Bottom 0.254: IC6.19 17.77,78.58 16.5,77.3 13.33,77.3 11.43,79.21 OUT5-6.15
N$97
  Bottom 0.254: IC6.2 17.77,70.95 16.5,69.69 12.06,69.69 11.43,70.32 10.16,70.32 8.89,71.59 OUT5-6.10
N$98
  Bottom 0.254: IC6.5 26.66,70.95 27.93,69.69 29.2,69.69 29.84,70.32 29.84,76.67 24.76,76.67 24.12,76.03 12.06,76.03 11.43,75.4 10.16,75.4 8.89,74.13 OUT5-6.12
N$99
  Bottom 0.254: IC6.6 27.93,72.22 26.66,73.5 14.6,73.5 13.97,72.86 7.62,72.86 6.98,73.5 6.98,76.67 7.62,76.67 OUT5-6.14
N$100
  Top 0.254: IC6.9 36.19,72.86 34.92,74.13 34.92,80.48 29.2,86.19 8.25,86.19 8.25,79.84 OUT5-6.16
N$101
  Bottom 0.254: IC15.3 95.24,59.52 97.15,61.43 116.83,61.43 IN5-6.2
N$102
  Bottom 0.254: IC15.4 96.52,58.25 95.24,56.98 93.97,56.98 93.34,57.62 93.34,63.97 116.83,63.97 IN5-6.4
N$103  (via drill 0.61)
  Top 0.254: v106.04,73.5 106.04,61.43 104.77,60.16 IC15.7
  Bottom 0.254: v106.04,73.5 116.2,73.5 116.83,72.86 118.1,72.86 118.74,72.22 118.74,67.14 117.47,67.14 IN5-6.6
N$104  (via drill 0.61)
  Top 0.254: v114.3,60.16 116.2,62.06 116.2,67.14 117.47,68.41 IN5-6.8
  Bottom 0.254: v114.3,60.16 113.66,60.8 109.21,60.8 107.94,59.52 IC15.8
N$105  (via drill 0.61)
  Top 0.254: v109.85,82.39 109.85,81.75 107.94,79.84 IC16.13 | v119.38,81.75 121.28,79.84 121.28,73.5 120.01,72.22 IN5-6.9
  Bottom 0.254: v109.85,82.39 110.48,81.75 v119.38,81.75
N$106
  Top 0.254: IC16.14 104.77,80.48 105.41,81.11 105.41,82.39 107.31,84.29 114.93,84.29 114.93,74.77 116.83,72.86 119.38,72.86 119.38,74.13 IN5-6.11
N$107
  Top 0.254: IC16.17 97.15,80.48 97.15,85.56 98.42,86.83 118.1,86.83 118.1,80.48 118.74,79.84 118.74,78.58 120.01,77.3 IN5-6.13
N$108
  Bottom 0.254: IC16.18 95.24,79.84 96.52,81.11 117.47,81.11 119.38,79.21 IN5-6.15
N$109  (via drill 0.61)
  Top 0.254: v107.31,62.7 107.31,65.24 IC15.13
  Bottom 0.254: v107.31,62.7 118.1,62.7 119.38,61.43 IN5-6.1
N$110  (via drill 0.61)
  Top 0.254: v103.5,73.5 103.5,69.05 104.77,67.78 IC15.14
  Bottom 0.254: v103.5,73.5 104.13,74.13 105.41,74.13 106.04,74.77 116.2,74.77 116.83,75.4 120.64,75.4 121.28,74.77 121.28,64.61 120.01,64.61 IN5-6.3
N$111
  Bottom 0.254: IC15.17 97.78,65.88 99.05,64.61 116.2,64.61 116.83,65.24 118.1,65.24 119.38,66.51 IN5-6.5
N$112  (via drill 0.61)
  Top 0.254: v115.56,69.05 116.83,70.32 120.01,70.32 120.01,69.69 IN5-6.7
  Bottom 0.254: v115.56,69.05 88.26,69.05 88.26,65.24 88.89,64.61 92.7,64.61 93.97,65.88 IC15.18
N$113
  Bottom 0.254: IC8.19 55.88,79.84 54.61,81.11 51.43,81.11 49.53,79.21 OUT7-8.15
N$114
  Bottom 0.254: IC8.16 63.5,78.58 61.59,76.67 49.53,76.67 OUT7-8.13
N$115
  Bottom 0.254: IC8.15 66.67,77.94 64.13,75.4 50.8,75.4 49.53,74.13 OUT7-8.11
N$116  (via drill 0.61)
  Top 0.254: v74.29,82.39 74.29,80.48 IC8.12 | v50.8,81.75 50.16,81.11 50.16,73.5 48.89,72.22 OUT7-8.9
  Bottom 0.254: v74.29,82.39 73.66,81.75 v50.8,81.75
N$117
  Bottom 0.254: IC8.2 55.88,70.95 54.61,69.69 50.16,69.69 49.53,70.32 48.26,70.32 46.98,71.59 OUT7-8.10
N$118  (via drill 0.61)
  Top 0.254: v64.13,76.67 64.13,72.86 IC8.5
  Bottom 0.254: v64.13,76.67 63.5,76.03 50.16,76.03 49.53,75.4 48.26,75.4 46.98,74.13 OUT7-8.12
N$119
  Bottom 0.254: IC8.6 66.03,72.22 64.77,73.5 52.7,73.5 52.07,72.86 45.72,72.86 45.08,73.5 45.08,76.67 45.72,76.67 OUT7-8.14
N$120  (via drill 0.61)
  Top 0.254: v73.02,83.02 73.02,74.13 74.29,72.86 IC8.9
  Bottom 0.254: v73.02,83.02 49.53,83.02 46.35,79.84 OUT7-8.16
N$121  (via drill 0.61)
  Top 0.254: v52.7,55.71 47.62,60.8 47.62,67.14 46.35,68.41 OUT7-8.8
  Bottom 0.254: v52.7,55.71 53.34,56.35 71.75,56.35 73.66,58.25 IC7.9
N$122
  Bottom 0.254: IC7.6 66.03,59.52 64.77,60.8 52.7,60.8 52.07,60.16 48.26,60.16 47.62,60.8 47.62,62.06 46.98,62.7 45.72,62.7 45.08,63.34 45.08,66.51 45.72,66.51 OUT7-8.6
N$123  (via drill 0.61)
  Top 0.254: v64.13,62.7 64.13,60.16 IC7.5
  Bottom 0.254: v64.13,62.7 63.5,63.34 50.16,63.34 49.53,62.7 48.26,62.7 46.98,63.97 OUT7-8.4
OUT00  (via drill 0.61)
  Top 0.254: v50.8,18.25 52.7,20.15 v52.7,36.66 | v49.53,37.94 48.89,38.57 48.89,39.84 IC10.15
  Bottom 0.254: v50.8,18.25 49.53,16.98 40,16.98 39.37,16.34 IC1.11 | v52.7,36.66 51.43,37.94 v49.53,37.94
OUT01  (via drill 0.61)
  Top 0.254: v50.16,29.68 50.16,37.3 51.43,38.57 51.43,39.84 IC10.14
  Bottom 0.254: v50.16,29.68 40,29.68 39.37,29.04 IC2.11
OUT02
  Bottom 0.254: IC3.11 39.37,40.48 40.64,39.2 52.07,39.2 53.34,40.48 IC10.13
OUT03  (via drill 0.61)
  Top 0.254: v56.51,48.09 56.51,42.38 IC10.12
  Bottom 0.254: v56.51,48.09 44.45,48.09 39.37,53.17 IC4.11
OUT04  (via drill 0.61)
  Top 0.254: v53.97,38.57 52.7,39.84 52.7,52.54 v46.35,58.89
  Bottom 0.254: v53.97,38.57 56.51,38.57 58.41,40.48 IC10.11 | v46.35,58.89 39.37,65.88 IC5.11
OUT05
  Top 0.254: IC10.10 61.59,42.38 62.86,43.65 62.86,55.08 65.4,57.62 65.4,67.78 62.86,70.32 62.86,80.48 58.41,84.92 38.73,84.92 38.73,80.48 IC6.11
OUT06  (via drill 0.61)
  Top 0.254: v75.56,41.11 75.56,63.97 76.83,65.24 IC7.11
  Bottom 0.254: v75.56,41.11 64.77,41.11 IC10.9
OUT07  (via drill 0.61)
  Top 0.254: v64.77,37.94 61.59,34.76 IC10.7 | v79.37,39.84 80.64,41.11 80.64,72.86 76.83,76.67 76.83,77.94 IC8.11
  Bottom 0.254: v64.77,37.94 66.67,39.84 v79.37,39.84
PIA-A0  (via drill 0.61)
  Top 0.254: IC6.3 20.95,70.32 20.95,69.05 22.22,67.78 22.22,65.24 21.58,64.61 21.58,60.8 20.95,60.16 IC5.3 20.95,57.62 20.95,56.35 22.22,55.08 22.22,52.54 21.58,51.91 21.58,48.09 20.95,47.46 IC4.3 20.95,44.92 20.95,43.65 22.22,42.38 22.22,39.84 21.58,39.2 21.58,35.39 20.95,34.76 IC3.3 20.95,32.22 21.58,31.58 21.58,30.31 22.22,29.68 22.22,25.87 20.95,24.6 20.95,22.06 IC2.3 20.95,19.52 20.95,18.25 22.22,16.98 22.22,10.63 20.95,9.36 IC1.3 20.95,6.82 22.86,4.92 38.1,4.92 40.64,7.46 | 40.64,7.46 40.64,24.6 43.81,27.77 CORE-IO.1 | IC7.3 59.05,60.16 60.32,61.43 60.32,67.78 59.05,69.05 59.05,70.32 IC8.3 | 93.34,18.25 93.34,10.63 92.07,9.36 IC11.2 | 93.34,18.25 92.07,19.52 IC12.2 | 93.34,30.95 92.07,32.22 IC13.2 | 93.34,18.25 93.34,30.95 | 93.34,43.65 92.07,44.92 IC14.2 | 93.34,30.95 93.34,43.65 | 93.34,56.35 92.07,57.62 IC15.2 | 93.34,43.65 93.34,56.35 | 93.34,56.35 93.34,69.05 92.07,70.32 IC16.2 | 40.64,7.46 41.91,6.18 v41.91,5.55
  Bottom 0.254: IC7.3 59.69,58.25 60.96,56.98 69.84,56.98 70.48,57.62 70.48,61.43 78.1,61.43 79.37,62.7 88.26,62.7 91.44,59.52 IC15.2 | v41.91,5.55 43.18,4.28 88.26,4.28 91.44,7.46 IC11.2
PIA-A1  (via drill 0.61)
  Top 0.254: IC16.5 99.69,70.32 99.69,69.05 100.96,67.78 100.96,61.43 99.69,60.16 IC15.5 99.69,57.62 100.32,56.98 100.32,55.71 100.96,55.08 100.96,48.73 99.69,47.46 IC14.5 99.69,44.92 99.69,43.65 100.96,42.38 100.96,39.84 100.32,39.2 100.32,35.39 99.69,34.76 IC13.5 99.69,32.22 99.69,30.95 100.96,29.68 100.96,27.14 100.32,26.5 100.32,22.7 99.69,22.06 IC12.5 99.69,19.52 99.69,18.25 100.96,16.98 100.96,10.63 99.69,9.36 IC11.5 | IC8.4 61.59,70.32 62.86,69.05 62.86,61.43 61.59,60.16 IC7.4 61.59,57.62 57.78,53.81 v57.78,29.68 | 24.76,18.25 24.76,10.63 23.49,9.36 IC1.4 | 24.76,18.25 23.49,19.52 IC2.4 | 24.76,30.95 23.49,32.22 IC3.4 | 24.76,18.25 24.76,30.95 | 24.76,43.65 23.49,44.92 IC4.4 | 24.76,30.95 24.76,43.65 | 24.76,56.35 23.49,57.62 IC5.4 | 24.76,43.65 24.76,56.35 | 24.76,56.35 24.76,69.05 23.49,70.32 IC6.4
  Bottom 0.254: 51.43,29.68 50.16,28.41 46.98,28.41 CORE-IO.2 | 51.43,29.68 51.43,30.31 50.8,30.31 49.53,31.58 27.93,31.58 27.3,32.22 26.66,31.58 25.39,31.58 24.12,32.85 IC3.4 | 51.43,29.68 53.34,29.68 | 53.34,29.68 v57.78,29.68 | 53.34,29.68 55.88,27.14 77.46,27.14 85.72,18.88 90.8,18.88 90.8,22.06 91.44,22.7 97.78,22.7 99.05,21.42 IC12.5
PIA-A2  (via drill 0.61)
  Top 0.254: IC1.7 31.11,9.36 32.38,10.63 32.38,16.98 31.11,18.25 31.11,19.52 IC2.7 31.11,22.06 31.74,22.7 31.74,26.5 32.38,27.14 32.38,29.68 31.11,30.95 31.11,32.22 IC3.7 31.11,34.76 31.74,35.39 31.74,39.2 32.38,39.84 32.38,42.38 31.11,43.65 31.11,44.92 IC4.7 31.11,47.46 31.74,48.09 31.74,51.91 32.38,52.54 32.38,55.08 31.11,56.35 31.11,57.62 IC5.7 31.11,60.16 31.74,60.8 31.74,64.61 32.38,65.24 32.38,67.78 31.11,69.05 31.11,70.32 IC6.7 | 67.94,61.43 69.21,60.16 IC7.7 | 67.94,61.43 67.94,69.05 69.21,70.32 IC8.7 | 103.5,18.25 103.5,10.63 102.23,9.36 IC11.6 | 103.5,18.25 102.23,19.52 IC12.6 | 103.5,30.95 102.23,32.22 IC13.6 | 103.5,30.95 103.5,18.25 | 103.5,43.65 102.23,44.92 IC14.6 | 103.5,43.65 103.5,30.95 | 103.5,56.35 102.23,57.62 IC15.6 | 103.5,56.35 103.5,43.65 | 103.5,56.35 103.5,67.78 102.86,68.41 102.86,69.69 102.23,70.32 IC16.6 | v67.94,43.65 67.94,61.43
  Bottom 0.254: CORE-IO.3 43.18,25.87 42.54,25.23 33.02,25.23 31.11,23.33 31.11,22.06 IC2.7 | IC8.7 69.84,70.95 71.11,69.69 83.81,69.69 86.99,72.86 88.26,72.86 88.89,73.5 100.32,73.5 101.59,72.22 IC16.6 | v67.94,43.65 33.65,43.65 31.74,45.55 IC4.7
PIA-A3  (via drill 0.61)
  Top 0.254: 34.92,18.25 34.92,10.63 33.65,9.36 IC1.8 | 34.92,18.25 33.65,19.52 IC2.8 | 34.92,30.95 33.65,32.22 IC3.8 | 34.92,18.25 34.92,30.95 | 34.92,43.65 33.65,44.92 IC4.8 | 34.92,30.95 34.92,43.65 | 34.92,56.35 33.65,57.62 IC5.8 | 34.92,43.65 34.92,56.35 | 34.92,56.35 34.92,69.05 33.65,70.32 IC6.8 | IC11.9 109.85,9.36 111.12,10.63 111.12,16.98 109.85,18.25 109.85,19.52 IC12.9 109.85,22.06 109.85,25.87 111.12,27.14 111.12,30.95 109.85,32.22 IC13.9 109.85,34.76 109.85,38.57 111.12,39.84 111.12,43.65 109.85,44.92 IC14.9 109.85,47.46 110.48,48.09 110.48,51.91 111.12,52.54 111.12,55.08 109.85,56.35 109.85,57.62 IC15.9 109.85,60.16 110.48,60.8 110.48,64.61 111.12,65.24 111.12,68.41 109.85,69.69 109.85,70.32 IC16.9 109.85,72.86 109.85,76.67 111.12,77.94 111.12,83.66 107.94,83.66 106.04,81.75 106.04,77.94 v103.5,75.4 | IC8.8 71.75,70.32 73.02,69.05 73.02,61.43 71.75,60.16 IC7.8 71.75,57.62 70.48,56.35 v70.48,44.28
  Bottom 0.254: CORE-IO.4 45.72,25.87 44.45,24.6 33.65,24.6 32.38,23.33 32.38,22.06 33.65,22.06 IC2.8 | v103.5,75.4 75.56,75.4 72.38,72.22 IC8.8 | v70.48,44.28 68.57,44.28 67.94,44.92 67.3,44.28 35.55,44.28 34.29,45.55 IC4.8
PIA-A4  (via drill 0.61)
  Top 0.254: 108.58,25.87 108.58,18.25 109.85,16.98 IC11.12 | 108.58,25.87 109.85,27.14 IC12.12 | 108.58,25.87 108.58,38.57 109.85,39.84 IC13.12 109.85,42.38 108.58,43.65 108.58,50.63 109.85,51.91 109.85,52.54 IC14.12 109.85,55.08 108.58,56.35 108.58,63.97 | 108.58,63.97 109.85,65.24 IC15.12 | 108.58,63.97 108.58,76.67 109.85,77.94 IC16.12 | IC7.13 71.75,67.78 70.48,69.05 70.48,76.67 71.75,77.94 IC8.13 71.11,79.84 v65.4,85.56 | 32.38,23.33 32.38,25.87 33.65,27.14 IC2.13 33.65,29.68 32.38,30.95 32.38,38.57 33.65,39.84 IC3.13 33.65,42.38 32.38,43.65 32.38,51.27 33.65,52.54 IC4.13 33.65,55.08 32.38,56.35 32.38,63.97 33.65,65.24 IC5.13 33.65,67.78 32.38,69.05 32.38,76.67 33.65,77.94 IC6.13 | 32.38,23.33 32.38,18.25 33.65,16.98 IC1.13 | 32.38,23.33 v33.65,23.33
  Bottom 0.254: v33.65,23.33 43.18,23.33 CORE-IO.5 | v65.4,85.56 64.77,84.92 43.18,84.92 39.37,81.11 35.55,81.11 34.29,79.84 IC6.13 | IC13.12 109.21,41.74 107.31,43.65 79.37,43.65 78.1,44.92 78.1,48.09 62.86,48.09 61.59,46.82 43.18,46.82 38.1,51.91 35.55,51.91 34.29,53.17 IC4.13
PIA-A5
  Top 0.254: 29.84,25.87 29.84,18.25 31.11,16.98 IC1.14 | 29.84,25.87 31.11,27.14 IC2.14 | 29.84,38.57 31.11,39.84 IC3.14 | 29.84,25.87 29.84,38.57 | 29.84,51.27 31.11,52.54 IC4.14 | 29.84,38.57 29.84,51.27 | 29.84,63.97 31.11,65.24 IC5.14 | 29.84,51.27 29.84,63.97 | 29.84,63.97 29.84,76.67 31.11,77.94 IC6.14 | IC11.15 102.23,16.98 100.96,18.25 100.96,25.87 102.23,27.14 IC12.15 102.23,29.68 100.96,30.95 100.96,38.57 102.23,39.84 IC13.15 102.23,42.38 100.96,43.65 100.96,47.46 102.23,48.73 102.23,52.54 IC14.15 102.23,55.08 100.96,56.35 100.96,60.16 102.23,61.43 102.23,65.24 IC15.15 102.23,67.78 100.96,69.05 100.96,76.67 102.23,77.94 IC16.15
  Bottom 0.254: IC2.14 31.74,27.77 33.02,26.5 39.37,26.5 40,27.14 47.62,27.14 47.62,25.23 46.35,23.96 CORE-IO.6 46.98,23.33 47.62,22.7 80.64,22.7 85.08,18.25 99.69,18.25 101.59,16.34 IC11.15 | IC7.14 69.21,67.78 69.21,69.69 68.57,69.69 67.94,70.32 67.94,78.58 68.57,78.58 IC8.14 69.84,78.58 71.11,77.3 80,77.3 80.64,77.94 88.26,77.94 88.89,77.3 100.32,77.3 101.59,78.58 IC16.15
PIA-A6  (via drill 0.61)
  Top 0.254: IC11.16 99.69,16.98 99.05,17.61 99.05,18.88 98.42,19.52 98.42,25.87 99.69,27.14 IC12.16 99.69,29.68 98.42,30.95 98.42,34.76 99.69,36.03 99.69,39.84 IC13.16 99.69,42.38 98.42,43.65 98.42,47.46 99.69,48.73 99.69,52.54 IC14.16 99.69,55.08 98.42,56.35 98.42,63.97 | 98.42,63.97 99.69,65.24 IC15.16 | 98.42,63.97 98.42,72.86 99.05,73.5 99.05,77.3 99.69,77.94 IC16.16 99.69,80.48 v99.69,83.66 | IC7.17 61.59,67.78 60.32,69.05 60.32,76.67 61.59,77.94 IC8.17 | IC1.17 23.49,16.98 22.22,18.25 22.22,24.6 23.49,25.87 23.49,27.14 IC2.17 23.49,29.68 22.22,30.95 22.22,38.57 23.49,39.84 IC3.17 23.49,42.38 22.22,43.65 22.22,51.27 23.49,52.54 IC4.17 23.49,55.08 22.22,56.35 22.22,63.97 23.49,65.24 IC5.17 23.49,67.78 22.22,69.05 22.22,76.67 23.49,77.94 IC6.17
  Bottom 0.254: CORE-IO.7 43.18,20.79 41.27,22.7 38.1,22.7 37.46,22.06 37.46,17.61 25.39,17.61 24.12,16.34 IC1.17 | 43.18,77.94 40,77.94 34.92,72.86 34.92,68.41 25.39,68.41 24.12,67.14 IC5.17 | 43.18,77.94 49.53,77.94 50.16,77.3 59.69,77.3 60.96,78.58 IC8.17 | v99.69,83.66 99.05,84.29 49.53,84.29 43.18,77.94
PIA-A7
  Top 0.254: 19.68,25.87 19.68,18.25 20.95,16.98 IC1.18 20.95,14.44 19.68,13.17 19.68,6.82 22.22,4.28 45.08,4.28 45.08,18.88 46.35,20.15 CORE-IO.8 | 19.68,25.87 20.95,27.14 IC2.18 | 19.68,38.57 20.95,39.84 IC3.18 | 19.68,25.87 19.68,38.57 | 19.68,51.27 20.95,52.54 IC4.18 | 19.68,38.57 19.68,51.27 | 19.68,63.97 20.95,65.24 IC5.18 | 19.68,51.27 19.68,63.97 | 19.68,63.97 19.68,76.67 20.95,77.94 IC6.18 | IC7.18 59.05,67.78 57.78,69.05 57.78,76.67 59.05,77.94 IC8.18 | 90.8,25.87 90.8,18.25 92.07,16.98 IC11.19 | 90.8,25.87 92.07,27.14 IC12.19 | 90.8,38.57 92.07,39.84 IC13.19 | 90.8,25.87 90.8,38.57 | 90.8,51.27 92.07,52.54 IC14.19 | 90.8,38.57 90.8,51.27 | 90.8,63.97 92.07,65.24 IC15.19 | 90.8,51.27 90.8,63.97 | 90.8,63.97 90.8,76.67 92.07,77.94 IC16.19
  Bottom 0.254: CORE-IO.8 46.98,20.79 48.26,19.52 52.7,19.52 54.61,17.61 90.16,17.61 91.44,16.34 IC11.19 | IC8.18 59.69,79.84 60.96,81.11 84.45,81.11 85.08,80.48 88.26,80.48 88.89,81.11 90.16,81.11 91.44,79.84 IC16.19
PIA-B0  (via drill 0.61)
  Top 0.254: 45.08,30.95 46.35,32.22 IC10.1 | 45.08,30.95 45.08,20.15 44.45,19.52 42.54,19.52 42.54,15.08 43.81,13.81 CORE-IO.13 | v48.26,45.55 45.08,42.38 45.08,30.95
  Bottom 0.254: v48.26,45.55 63.5,45.55 IC9.1
PIA-B1  (via drill 0.61)
  Top 0.254: v48.89,13.17 48.89,32.22 IC10.2 | v66.67,30.31 66.67,44.92 IC9.2
  Bottom 0.254: v48.89,13.17 46.98,13.17 CORE-IO.14 | v66.67,30.31 66.03,30.95 51.43,30.95 49.53,32.85 IC10.2
PIA-B2  (via drill 0.61)
  Top 0.254: v67.94,31.58 69.21,32.85 69.21,44.92 IC9.3 | v48.89,11.9 50.16,13.17 50.16,17.61 49.53,18.25 49.53,27.77 51.43,29.68 51.43,32.22 IC10.3
  Bottom 0.254: v67.94,31.58 53.34,31.58 52.07,32.85 IC10.3 | v48.89,11.9 45.72,11.9 44.45,10.63 CORE-IO.15
PIA-B3
  Bottom 0.254: IC17.1 53.34,12.54 51.43,10.63 46.98,10.63 CORE-IO.16
PIA-B4
  Bottom 0.254: IC17.2 55.88,12.54 52.7,9.36 45.72,9.36 44.45,8.09 CORE-IO.17
PIA-B5
  Bottom 0.254: IC17.3 58.41,12.54 53.97,8.09 46.98,8.09 CORE-IO.18
PIA-B6  (via drill 0.61)
  Top 0.254: 60.32,32.22 62.86,29.68 65.4,29.68 65.4,27.77 66.03,27.14 67.94,27.14 67.94,30.31 71.75,34.12 71.75,44.92 IC9.4 | 60.32,32.22 59.69,32.85 IC10.6 | v55.24,6.82 60.32,11.9 60.32,32.22
  Bottom 0.254: v55.24,6.82 45.72,6.82 44.45,5.55 CORE-IO.19
PIA-B7
  Top 0.254: JP1.17 76.19,25.87 74.92,27.14 70.48,27.14 70.48,19.52 64.77,13.81 IC17.5
  Bottom 0.254: IC17.5 63.5,12.54 56.51,5.55 46.98,5.55 CORE-IO.20
VCC  (via drill 0.61)
  Top 0.508: BYP8.1 52.07,79.21 53.34,79.21 IC8.20 53.97,77.94 55.24,76.67 55.24,69.05 53.97,67.78 IC7.20 53.97,65.24 55.24,63.97 55.24,23.33 53.97,22.06 IC17.16 53.97,19.52 52.7,18.25 52.7,7.46 54.61,5.55 66.03,5.55 66.03,12.54 IC17.6 | BYP12.1 87.62,28.41 88.89,28.41 IC12.20 | 88.26,15.71 88.89,15.71 IC11.20 | 88.26,15.71 87.62,15.71 BYP11.1 | 88.26,15.71 88.26,25.87 89.53,27.14 IC12.20 | BYP6.1 13.97,79.21 15.24,79.21 IC6.20 15.87,77.94 17.14,76.67 17.14,69.05 15.87,67.78 IC5.20 15.87,65.24 15.87,61.43 13.33,58.89 13.33,54.45 BYP4.1 | BYP1.1 13.33,16.34 13.33,21.42 15.87,23.96 15.87,27.14 IC2.20 | BYP3.1 13.33,41.74 13.33,46.82 15.87,49.37 15.87,52.54 IC4.20 | BYP2.1 13.33,29.04 13.33,31.58 14.6,32.85 14.6,36.66 15.87,37.94 15.87,39.84 IC3.20 16.5,41.74 v18.41,43.65 | IC11.11 112.39,16.98 111.12,18.25 111.12,25.87 112.39,27.14 IC12.11 112.39,29.68 112.39,30.95 111.12,32.22 111.12,38.57 112.39,39.84 IC13.11 112.39,42.38 111.75,43.02 111.75,44.28 111.12,44.92 111.12,51.27 112.39,52.54 IC14.11 112.39,55.08 111.12,56.35 111.12,63.97 112.39,65.24 IC15.11 112.39,67.78 112.39,68.41 111.12,69.69 111.12,76.67 112.39,77.94 IC16.11 | JP2.2 82.55,77.3 83.81,78.58 83.81,82.39 84.45,83.02 86.99,83.02 86.99,79.84 BYP16.1 87.62,79.21 88.89,79.21 IC16.20 89.53,77.94 88.26,76.67 88.26,66.51 | 88.26,66.51 88.89,66.51 IC15.20 89.53,65.24 88.26,63.97 88.26,53.81 | 88.26,66.51 87.62,66.51 BYP15.1 | 88.26,53.81 88.89,53.81 IC14.20 89.53,52.54 88.26,51.27 88.26,41.11 | 88.26,53.81 87.62,53.81 BYP14.1 | 88.26,41.11 88.89,41.11 IC13.20 | 88.26,41.11 87.62,41.11 BYP13.1
  Top 0.508: v60.32,39.2 60.32,51.91 61.59,53.17 BYP9.1 | 88.26,41.11 88.26,30.95 89.53,29.68 IC12.20
  Bottom 0.508: BYP7.1 52.07,66.51 53.34,66.51 IC7.20 | CORE-IO.11 44.45,15.71 45.72,15.71 CORE-IO.12 46.98,15.71 47.62,16.34 50.16,16.34 50.8,16.98 70.48,16.98 76.19,11.27 | BYP17.1 52.07,20.79 53.34,20.79 IC17.16 | 76.19,11.27 80.64,11.27 81.27,11.9 BYP18.1 82.55,11.9 86.35,15.71 BYP11.1 | 76.19,11.27 68.57,11.27 67.3,12.54 IC17.6 | BYP5.1 13.97,66.51 15.24,66.51 IC5.20 | BYP1.1 13.97,15.71 15.24,15.71 IC1.20 | BYP2.1 13.97,28.41 15.24,28.41 IC2.20 | BYP3.1 13.97,41.11 15.24,41.11 IC3.20 | BYP4.1 13.97,53.81 15.24,53.81 IC4.20 | BYP9.1 62.23,53.81 63.5,53.81 IC9.16 | BYP10.1 44.45,41.11 45.72,41.11 IC10.16 46.98,41.74 48.26,43.02 | 79.37,42.38 80.64,41.11 86.35,41.11 BYP13.1 | 79.37,42.38 76.83,44.92 IC9.6 | 60.32,43.02 66.67,43.02 67.3,42.38 79.37,42.38 | 48.26,43.02 60.32,43.02 | 60.32,43.02 v60.32,39.2 | IC15.11 111.75,67.14 110.48,68.41 91.44,68.41 90.16,67.14 IC15.20 | v18.41,43.65 19.04,43.02 48.26,43.02

### Text on the board
Top: PA8PDP/VRS | Component Side
Bottom: Solder Side
tValues: RealConsole I/O - Rev.1 | + | - | +